# Altium schematic sheet LPCB279 - RM57 LAUNCH.SchDoc
size A3; Address1: Factory 10; Address2: 9-13 Dingley Avenue, Dandeong, VICTORIA 3175, AUSTRALIA; DocumentNumber: 7; Revision: 1; SheetNumber: 7; SheetTotal: 7; Lockie__PCB_SUB_ASSEMBLY: PCB Sub Component; Lockie__PCB_ASSEMBLY: PCB Assembly; Lockie__LDL: LPCB279; Lockie__PCB_DESCRIPTION: Landing Gear Unit
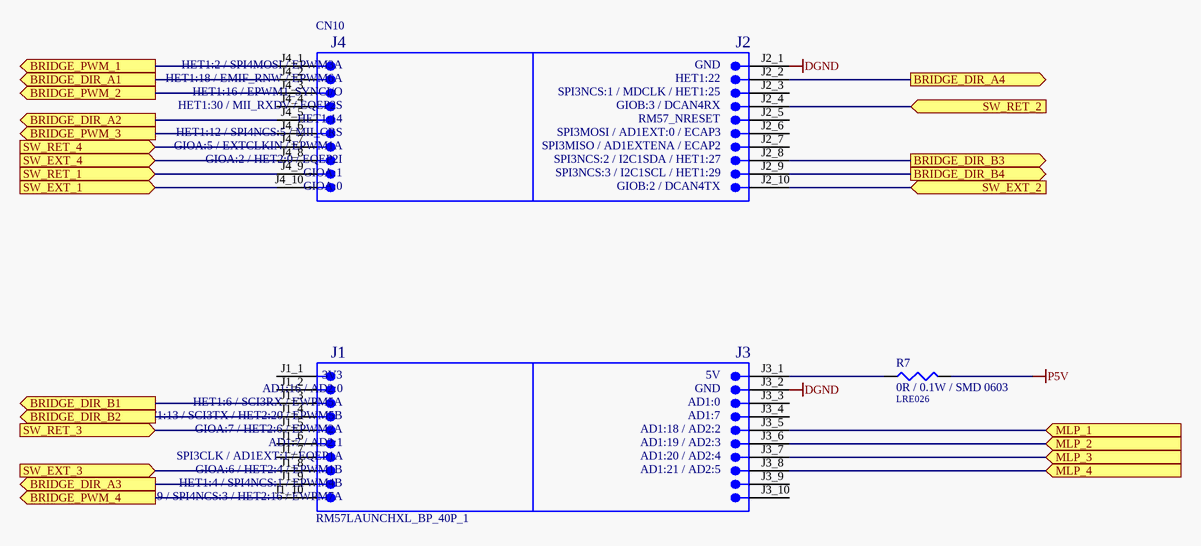
[diagram p0: LPCB279 - RM57 LAUNCH.SchDoc]

## Parts
CN10  RM57LAUNCHXL_BP_40P_1  [RM57LAUNCHXL_BP_40P_1]  (no BOM)
R7  0R / 0.1W / SMD 0603  LDL_NUMBER: LRE026  [LFP020__CR1608-0603-IPC7351_B]

## Ports
BRIDGE_DIR_A1 (out), BRIDGE_DIR_A2 (out), BRIDGE_DIR_A3 (out), BRIDGE_DIR_A4 (out), BRIDGE_DIR_B1 (out), BRIDGE_DIR_B2 (out), BRIDGE_DIR_B3 (out), BRIDGE_DIR_B4 (out), BRIDGE_PWM_1 (out), BRIDGE_PWM_2 (out), BRIDGE_PWM_3 (out), BRIDGE_PWM_4 (out), MLP_1 (in), MLP_2 (in), MLP_3 (in), MLP_4 (in), SW_EXT_1 (in), SW_EXT_2 (in), SW_EXT_3 (in), SW_EXT_4 (in), SW_RET_1 (in), SW_RET_2 (in), SW_RET_3 (in), SW_RET_4 (in)

## Nets
DGND: CN10.J2_1 CN10.J3_2
P5V: R7.2
BRIDGE_DIR_A1: CN10.J4_2 ; port BRIDGE_DIR_A1
BRIDGE_DIR_A2: CN10.J4_5 ; port BRIDGE_DIR_A2
BRIDGE_DIR_A3: CN10.J1_9 ; port BRIDGE_DIR_A3
BRIDGE_DIR_A4: CN10.J2_2 ; port BRIDGE_DIR_A4
BRIDGE_DIR_B1: CN10.J1_3 ; port BRIDGE_DIR_B1
BRIDGE_DIR_B2: CN10.J1_4 ; port BRIDGE_DIR_B2
BRIDGE_DIR_B3: CN10.J2_8 ; port BRIDGE_DIR_B3
BRIDGE_DIR_B4: CN10.J2_9 ; port BRIDGE_DIR_B4
BRIDGE_PWM_1: CN10.J4_1 ; port BRIDGE_PWM_1
BRIDGE_PWM_2: CN10.J4_3 ; port BRIDGE_PWM_2
BRIDGE_PWM_3: CN10.J4_6 ; port BRIDGE_PWM_3
BRIDGE_PWM_4: CN10.J1_10 ; port BRIDGE_PWM_4
MLP_1: CN10.J3_5 ; port MLP_1
MLP_2: CN10.J3_6 ; port MLP_2
MLP_3: CN10.J3_7 ; port MLP_3
MLP_4: CN10.J3_8 ; port MLP_4
SW_EXT_1: CN10.J4_10 ; port SW_EXT_1
SW_EXT_2: CN10.J2_10 ; port SW_EXT_2
SW_EXT_3: CN10.J1_8 ; port SW_EXT_3
SW_EXT_4: CN10.J4_8 ; port SW_EXT_4
SW_RET_1: CN10.J4_9 ; port SW_RET_1
SW_RET_2: CN10.J2_4 ; port SW_RET_2
SW_RET_3: CN10.J1_5 ; port SW_RET_3
SW_RET_4: CN10.J4_7 ; port SW_RET_4
NetCN10_J3_1: CN10.J3_1 R7.1

Not connected (* = marked no-connect by the designer): CN10 J1_1 J1_2 J1_6 J1_7 J2_3 J2_5 J2_6 J2_7 J3_3 J3_4 J3_9 J3_10 J4_4

## Notes on the sheet
- PCB COMPONENT DESCRIPTION
- LDL NUMBER
- Assembly Details
- Size
- Drawing File Name
- Revision
- http://sil3.com.au
  ACN: 123 529 064
  Factory 10
  9-13 Dingley Avenue
  Dandenong, VICTORIA
  Australia
- Scale
- A3
- Sheet Details
- N.T.S
- Sheet:
- Of:
- (in symbol RM57LAUNCHXL_BP_40P_1) J4; J2; HET1:2 / SPI4MOSI / EPWM3A; GND; HET1:18 / EMIF_RNW / EPWM6A; HET1:22; HET1:16 / EPWM1_SYNCI/O; SPI3NCS:1 / MDCLK / HET1:25; HET1:30 / MII_RXDV / EQEP2S; GIOB:3 / DCAN4RX; HET1:14; RM57_NRESET; HET1:12 / SPI4NCS:5 / MII_CRS; SPI3MOSI / AD1EXT:0 / ECAP3; GIOA:5 / EXTCLKIN / EPWM1A; SPI3MISO / AD1EXTENA / ECAP2; GIOA:2 / HET2:0 / EQEP2I; SPI3NCS:2 / I2C1SDA / HET1:27; GIOA:1; SPI3NCS:3 / I2C1SCL / HET1:29; GIOA:0; GIOB:2 / DCAN4TX; J1; J3; 3V3; 5V; AD1:16 / AD2:0; HET1:6 / SCI3RX / EWPM5A; AD1:0; HET1:13 / SCI3TX / HET2:20 / EPWM5B; AD1:7; GIOA:7 / HET2:6 / EPWM2A; AD1:18 / AD2:2; AD1:7 / AD2:1; AD1:19 / AD2:3; SPI3CLK / AD1EXT:1 / EQEP1A; AD1:20 / AD2:4; GIOA:6 / HET2:4 / EPWM1B; AD1:21 / AD2:5; HET1:4 / SPI4NCS:1 / EPWM4B; HET1:9 / SPI4NCS:3 / HET2:16 / EWPM7A

## Library data of the parts
CN10 = RM57LAUNCHXL_BP_40P_1: Connector, RM57L843 LaunchXL, 40Pin Boosterpack Site1; FMEDA__CHANNEL: COM; FMEDA__OPERATING__CURRENT_MAX: 0; FMEDA__OPERATING__TEMP_MAX: 50; FMEDA__OPERATING__TEMP_MIN: -20; FMEDA__OPERATING__TEMP_TYP: 27; FMEDA__OPERATING__VOLTAGE_MAX: 16; FMEDA__OPERATING__VOLTAGE_TYP: 12; FMEDA__FUNCTION_IN_SYSTEM: *; FMEDA__OPERATING__CURRENT_MIN: 0; FMEDA__OPERATING__CURRENT_TYP: 0; FMEDA__OPERATING__VOLTAGE_MIN: 0
R7 = 0R / 0.1W / SMD 0603: Resistor, Ceramic Chip, 0R, 0.1W, SMD 0603 [LRE026]; Value: 0; FMEDA__OPERATING__TEMP_MAX: 50; FMEDA__OPERATING__TEMP_MIN: -20; FMEDA__OPERATING__TEMP_TYP: 27; FMEDA__CHANNEL: COM; FMEDA__OPERATING__POWER_MAX: 0; FMEDA__OPERATING__POWER_MIN: 0; FMEDA__OPERATING__VOLTAGE_MAX: 0; FMEDA__OPERATING__VOLTAGE_MIN: 0; FMEDA__OPERATING__VOLTAGE_TYP: 0; FMEDA__FUNCTION_IN_SYSTEM: *